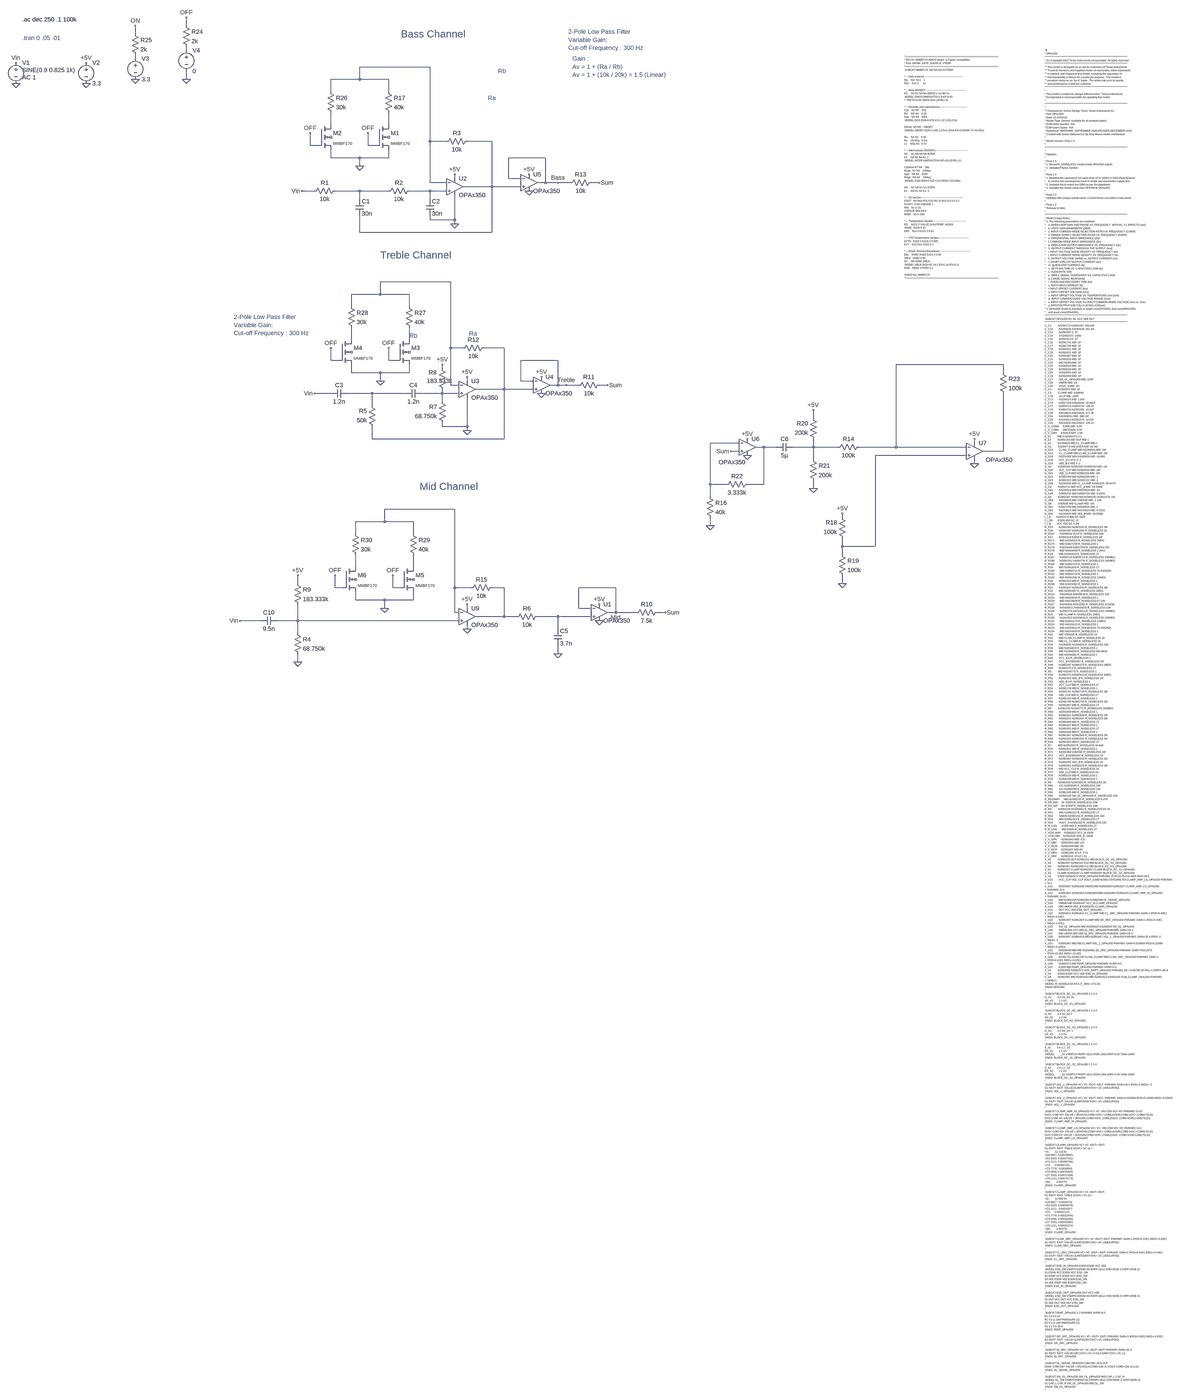
[diagram p0: schematic Filters.asc, whole sheet]
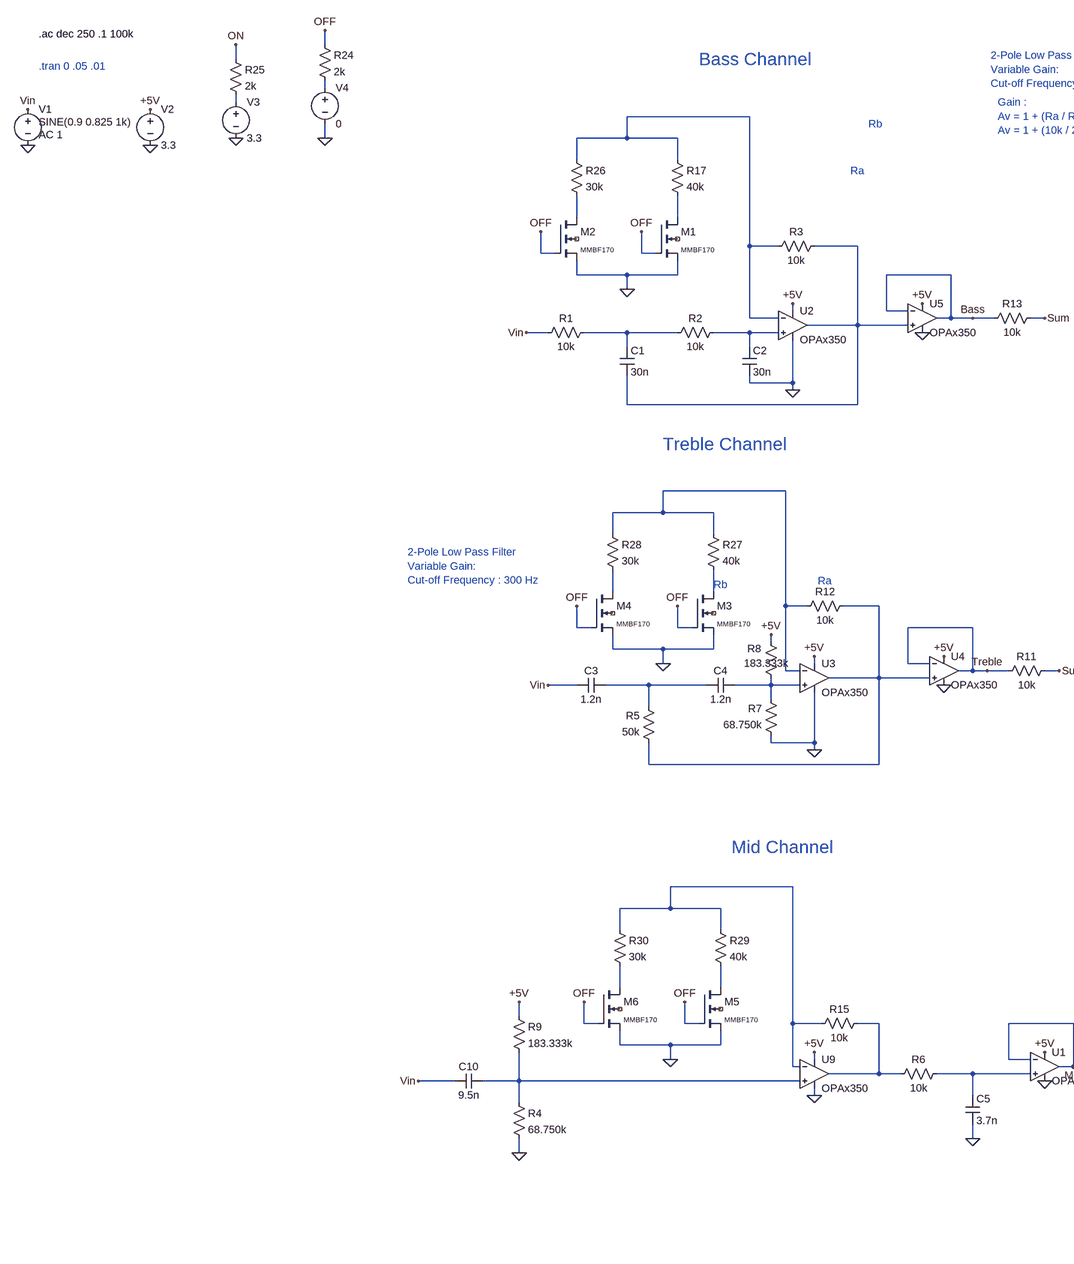
[diagram p1: schematic Filters.asc, part, row 1 of 2, column 1 of 2]
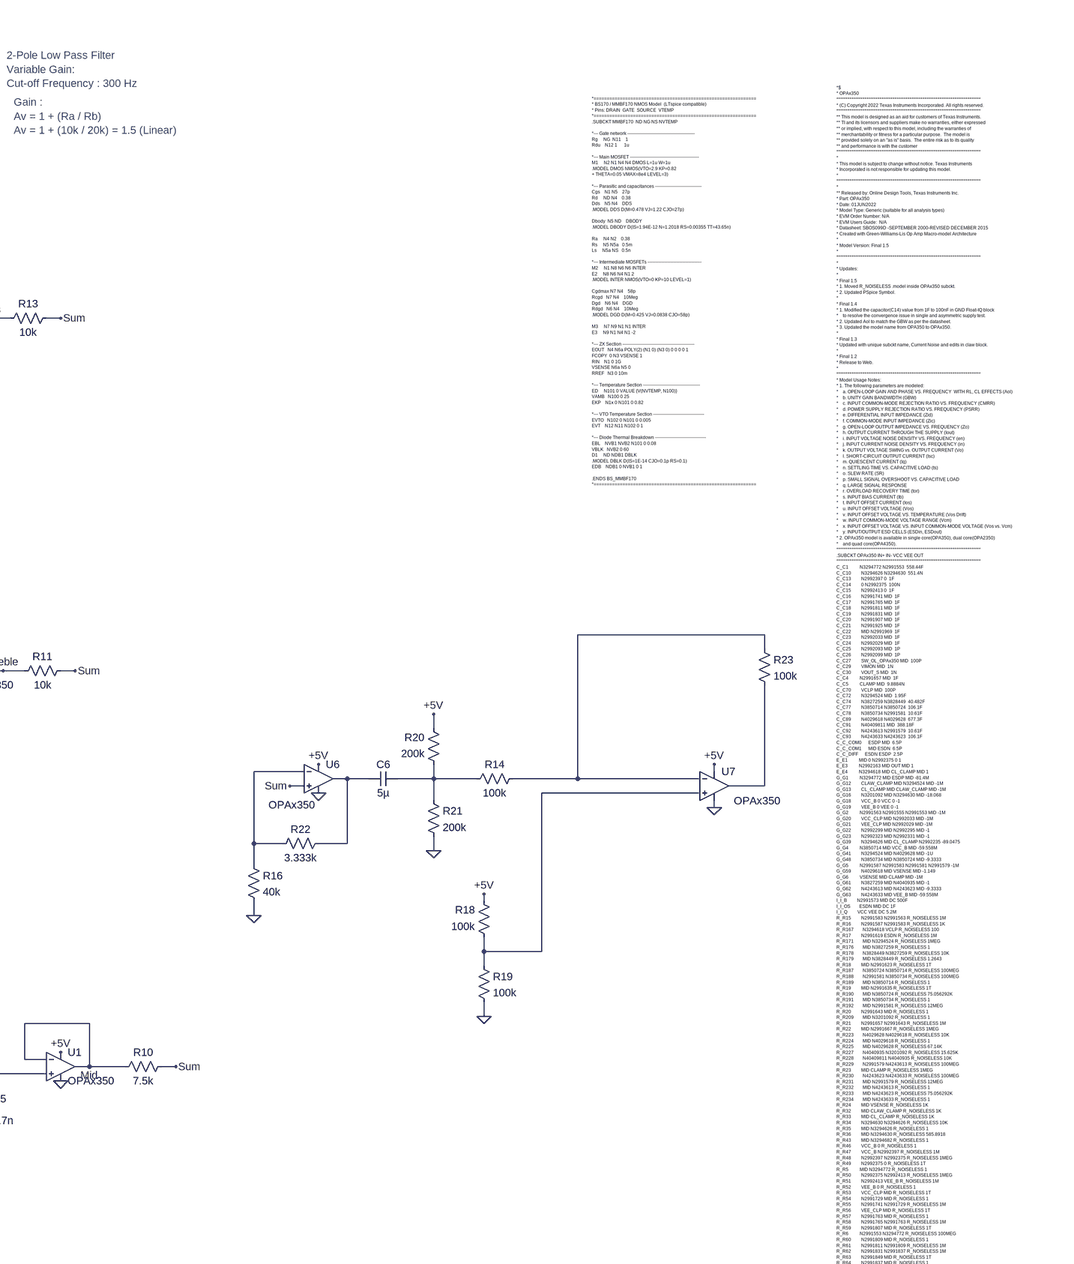
[diagram p2: schematic Filters.asc, part, row 1 of 2, column 2 of 2]
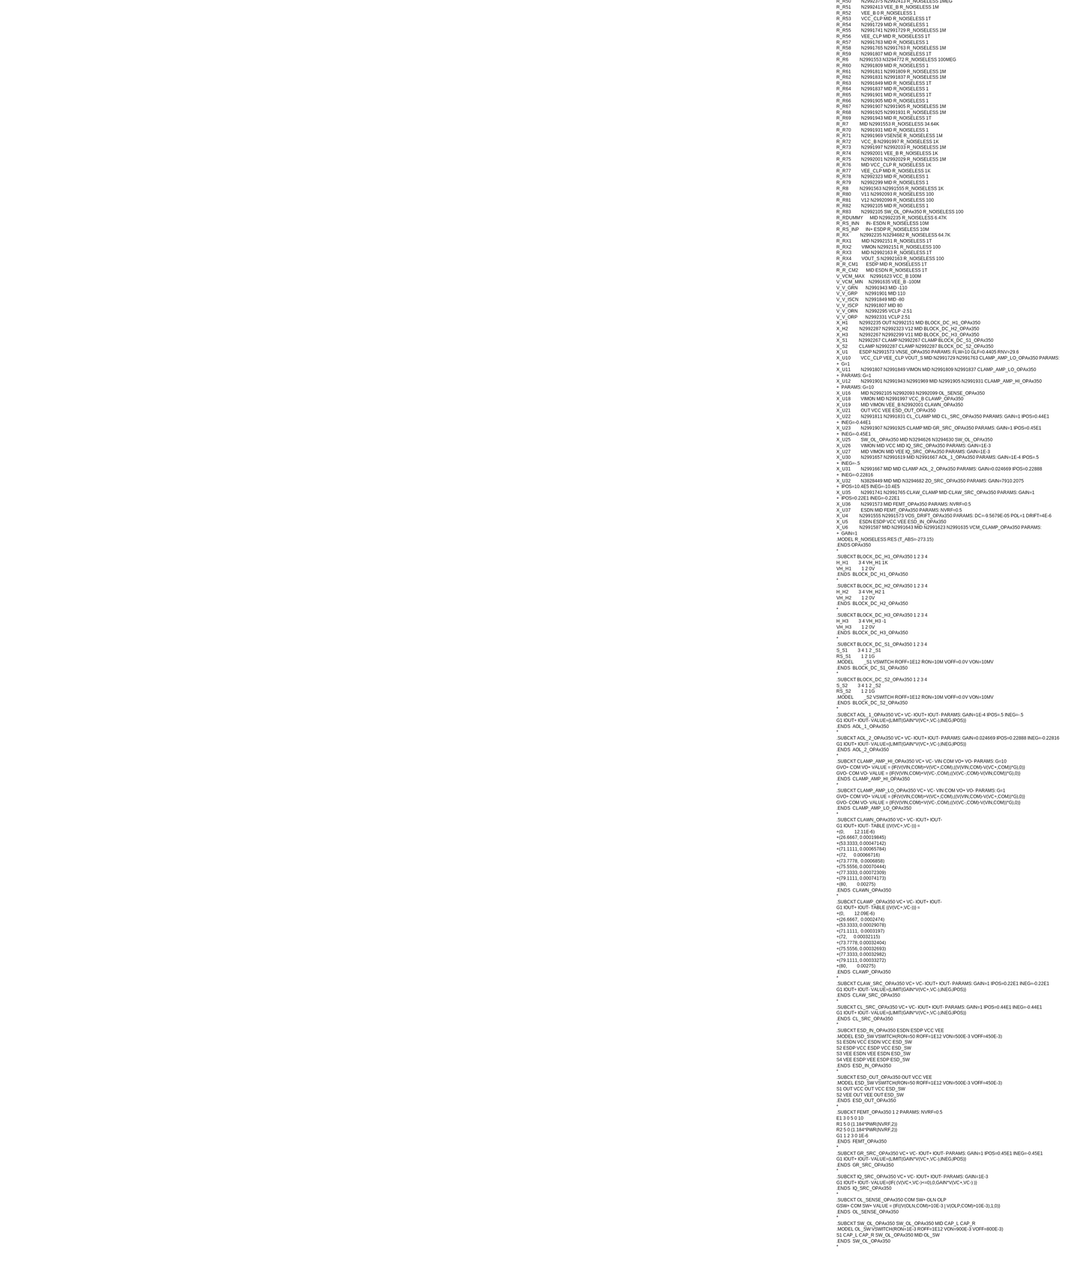
[diagram p3: schematic Filters.asc, part, row 2 of 2, column 2 of 2]
* Filters.asc
V1 Vin 0 SINE(0.9 0.825 1k) AC 1
V2 +5V 0 3.3
X§U2 N008 N003 +5V 0 N006 OPAx350  ; pins In+ In- V+ V- OUT
R1 N007 Vin 10k
R2 N008 N007 10k
C1 N007 N006 30n
C2 N008 0 30n
R3 N006 N003 10k
X§U3 N015 N009 +5V 0 N012 OPAx350  ; pins In+ In- V+ V- OUT
R5 N012 N014 50k
R7 0 N015 68.750k
C3 N014 Vin 1.2n
C4 N015 N014 1.2n
R12 N012 N009 10k
R8 +5V N015 183.333k
X§U9 N026 N021 +5V 0 N024 OPAx350  ; pins In+ In- V+ V- OUT
C10 N026 Vin 9.5n
R4 N026 0 68.750k
R6 N025 N024 10k
C5 N025 0 3.7n
R9 +5V N026 183.333k
X§U1 N025 Mid +5V 0 Mid OPAx350  ; pins In+ In- V+ V- OUT
X§U4 N012 Treble +5V 0 Treble OPAx350  ; pins In+ In- V+ V- OUT
X§U5 N006 Bass +5V 0 Bass OPAx350  ; pins In+ In- V+ V- OUT
X§U6 Sum N016 +5V 0 N017 OPAx350  ; pins In+ In- V+ V- OUT
R10 Sum Mid 7.5k
R11 Sum Treble 10k
R13 Sum Bass 10k
R15 N024 N021 10k
X§U7 N020 N013 +5V 0 N019 OPAx350  ; pins In+ In- V+ V- OUT
R14 N013 N018 100k
R18 N020 +5V 100k
R19 N020 0 100k
C6 N018 N017 5µ
R20 N018 +5V 200k
R21 N018 0 200k
R22 N017 N016 3.333k
R16 N016 0 40k
R23 N013 N019 100k
V3 N002 0 3.3
R25 ON N002 2k
X§M1 N005 OFF 0 NC_01 MMBF170  ; pins D G S B
R17 N003 N005 40k
R26 N003 N004 30k
X§M2 N004 OFF 0 NC_02 MMBF170  ; pins D G S B
X§M3 N011 OFF 0 NC_03 MMBF170  ; pins D G S B
R27 N009 N011 40k
R28 N009 N010 30k
X§M4 N010 OFF 0 NC_04 MMBF170  ; pins D G S B
X§M5 N023 OFF 0 NC_05 MMBF170  ; pins D G S B
R29 N021 N023 40k
R30 N021 N022 30k
X§M6 N022 OFF 0 NC_06 MMBF170  ; pins D G S B
V4 N001 0 0
R24 OFF N001 2k
*$
* OPAx350
*****************************************************************************
* (C) Copyright 2022 Texas Instruments Incorporated. All rights reserved.
*****************************************************************************
** This model is designed as an aid for customers of Texas Instruments.
** TI and its licensors and suppliers make no warranties, either expressed
** or implied, with respect to this model, including the warranties of
** merchantability or fitness for a particular purpose.  The model is
** provided solely on an "as is" basis.  The entire risk as to its quality
** and performance is with the customer
*****************************************************************************
*
* This model is subject to change without notice. Texas Instruments
* Incorporated is not responsible for updating this model.
*
*****************************************************************************
*
** Released by: Online Design Tools, Texas Instruments Inc.
* Part: OPAx350
* Date: 01JUN2022
* Model Type: Generic (suitable for all analysis types)
* EVM Order Number: N/A
* EVM Users Guide:  N/A
* Datasheet: SBOS099D -SEPTEMBER 2000-REVISED DECEMBER 2015
* Created with Green-Williams-Lis Op Amp Macro-model Architecture
*
* Model Version: Final 1.5
*
*****************************************************************************
*
* Updates:
*
* Final 1.5
* 1. Moved R_NOISELESS .model inside OPAx350 subckt.
* 2. Updated PSpice Symbol.
*
* Final 1.4
* 1. Modified the capacitor(C14) value from 1F to 100nF in GND Float-IQ block
*    to resolve the convergence issue in single and asymmetric supply test.
* 2. Updated Aol to match the GBW as per the datasheet.
* 3. Updated the model name from OPA350 to OPAx350.
*
* Final 1.3
* Updated with unique subckt name, Current Noise and edits in claw block.
*
* Final 1.2
* Release to Web.
*
*****************************************************************************
* Model Usage Notes:
* 1. The following parameters are modeled:
*    a. OPEN-LOOP GAIN AND PHASE VS. FREQUENCY  WITH RL, CL EFFECTS (Aol)
*    b. UNITY GAIN BANDWIDTH (GBW)
*    c. INPUT COMMON-MODE REJECTION RATIO VS. FREQUENCY (CMRR)
*    d. POWER SUPPLY REJECTION RATIO VS. FREQUENCY (PSRR)
*    e. DIFFERENTIAL INPUT IMPEDANCE (Zid)
*    f. COMMON-MODE INPUT IMPEDANCE (Zic)
*    g. OPEN-LOOP OUTPUT IMPEDANCE VS. FREQUENCY (Zo)
*    h. OUTPUT CURRENT THROUGH THE SUPPLY (Iout)
*    i. INPUT VOLTAGE NOISE DENSITY VS. FREQUENCY (en)
*    j. INPUT CURRENT NOISE DENSITY VS. FREQUENCY (in)
*    k. OUTPUT VOLTAGE SWING vs. OUTPUT CURRENT (Vo)
*    l. SHORT-CIRCUIT OUTPUT CURRENT (Isc)
*    m. QUIESCENT CURRENT (Iq)
*    n. SETTLING TIME VS. CAPACITIVE LOAD (ts)
*    o. SLEW RATE (SR)
*    p. SMALL SIGNAL OVERSHOOT VS. CAPACITIVE LOAD
*    q. LARGE SIGNAL RESPONSE
*    r. OVERLOAD RECOVERY TIME (tor)
*    s. INPUT BIAS CURRENT (Ib)
*    t. INPUT OFFSET CURRENT (Ios)
*    u. INPUT OFFSET VOLTAGE (Vos)
*    v. INPUT OFFSET VOLTAGE VS. TEMPERATURE (Vos Drift)
*    w. INPUT COMMON-MODE VOLTAGE RANGE (Vcm)
*    x. INPUT OFFSET VOLTAGE VS. INPUT COMMON-MODE VOLTAGE (Vos vs. Vcm)
*    y. INPUT/OUTPUT ESD CELLS (ESDin, ESDout)
* 2. OPAx350 model is available in single core(OPA350), dual core(OPA2350)
*    and quad core(OPA4350).
*****************************************************************************
.SUBCKT OPAx350 IN+ IN- VCC VEE OUT
*****************************************************************************
C_C1          N3294772 N2991553  558.44F
C_C10         N3294626 N3294630  551.4N
C_C13         N2992397 0  1F
C_C14         0 N2992375  100N
C_C15         N2992413 0  1F
C_C16         N2991741 MID  1F
C_C17         N2991765 MID  1F
C_C18         N2991811 MID  1F
C_C19         N2991831 MID  1F
C_C20         N2991907 MID  1F
C_C21         N2991925 MID  1F
C_C22         MID N2991969  1F
C_C23         N2992033 MID  1F
C_C24         N2992029 MID  1F
C_C25         N2992093 MID  1P
C_C26         N2992099 MID  1P
C_C27         SW_OL_OPAx350 MID  100P
C_C29         VIMON MID  1N
C_C30         VOUT_S MID  1N
C_C4          N2991657 MID  1F
C_C5          CLAMP MID  9.8884N
C_C70         VCLP MID  100P
C_C72         N3294524 MID  1.95F
C_C74         N3827259 N3828449  40.482F
C_C77         N3850714 N3850724  106.1F
C_C78         N3850734 N2991581  10.61F
C_C89         N4029618 N4029628  677.3F
C_C91         N40409811 MID  388.18F
C_C92         N4243613 N2991579  10.61F
C_C93         N4243633 N4243623  106.1F
C_C_COM0      ESDP MID  6.5P
C_C_COM1      MID ESDN  6.5P
C_C_DIFF      ESDN ESDP  2.5P
E_E1          MID 0 N2992375 0 1
E_E3          N2992163 MID OUT MID 1
E_E4          N3294618 MID CL_CLAMP MID 1
G_G1          N3294772 MID ESDP MID -81.4M
G_G12         CLAW_CLAMP MID N3294524 MID -1M
G_G13         CL_CLAMP MID CLAW_CLAMP MID -1M
G_G16         N3201092 MID N3294630 MID -18.068
G_G18         VCC_B 0 VCC 0 -1
G_G19         VEE_B 0 VEE 0 -1
G_G2          N2991563 N2991555 N2991553 MID -1M
G_G20         VCC_CLP MID N2992033 MID -1M
G_G21         VEE_CLP MID N2992029 MID -1M
G_G22         N2992299 MID N2992295 MID -1
G_G23         N2992323 MID N2992331 MID -1
G_G39         N3294626 MID CL_CLAMP N2992235 -89.0475
G_G4          N3850714 MID VCC_B MID -59.558M
G_G41         N3294524 MID N4029628 MID -1U
G_G48         N3850734 MID N3850724 MID -9.3333
G_G5          N2991587 N2991583 N2991581 N2991579 -1M
G_G59         N4029618 MID VSENSE MID -1.149
G_G6          VSENSE MID CLAMP MID -1M
G_G61         N3827259 MID N4040935 MID -1
G_G62         N4243613 MID N4243623 MID -9.3333
G_G63         N4243633 MID VEE_B MID -59.558M
I_I_B         N2991573 MID DC 500F
I_I_OS        ESDN MID DC 1F
I_I_Q         VCC VEE DC 5.2M
R_R15         N2991583 N2991563 R_NOISELESS 1M
R_R16         N2991587 N2991583 R_NOISELESS 1K
R_R167        N3294618 VCLP R_NOISELESS 100
R_R17         N2991619 ESDN R_NOISELESS 1M
R_R171        MID N3294524 R_NOISELESS 1MEG
R_R176        MID N3827259 R_NOISELESS 1
R_R178        N3828449 N3827259 R_NOISELESS 10K
R_R179        MID N3828449 R_NOISELESS 1.2643
R_R18         MID N2991623 R_NOISELESS 1T
R_R187        N3850724 N3850714 R_NOISELESS 100MEG
R_R188        N2991581 N3850734 R_NOISELESS 100MEG
R_R189        MID N3850714 R_NOISELESS 1
R_R19         MID N2991635 R_NOISELESS 1T
R_R190        MID N3850724 R_NOISELESS 75.056292K
R_R191        MID N3850734 R_NOISELESS 1
R_R192        MID N2991581 R_NOISELESS 12MEG
R_R20         N2991643 MID R_NOISELESS 1
R_R209        MID N3201092 R_NOISELESS 1
R_R21         N2991657 N2991643 R_NOISELESS 1M
R_R22         MID N2991667 R_NOISELESS 1MEG
R_R223        N4029628 N4029618 R_NOISELESS 10K
R_R224        MID N4029618 R_NOISELESS 1
R_R225        MID N4029628 R_NOISELESS 67.14K
R_R227        N4040935 N3201092 R_NOISELESS 15.625K
R_R228        N40409811 N4040935 R_NOISELESS 10K
R_R229        N2991579 N4243613 R_NOISELESS 100MEG
R_R23         MID CLAMP R_NOISELESS 1MEG
R_R230        N4243623 N4243633 R_NOISELESS 100MEG
R_R231        MID N2991579 R_NOISELESS 12MEG
R_R232        MID N4243613 R_NOISELESS 1
R_R233        MID N4243623 R_NOISELESS 75.056292K
R_R234        MID N4243633 R_NOISELESS 1
R_R24         MID VSENSE R_NOISELESS 1K
R_R32         MID CLAW_CLAMP R_NOISELESS 1K
R_R33         MID CL_CLAMP R_NOISELESS 1K
R_R34         N3294630 N3294626 R_NOISELESS 10K
R_R35         MID N3294626 R_NOISELESS 1
R_R36         MID N3294630 R_NOISELESS 585.8918
R_R43         MID N3294682 R_NOISELESS 1
R_R46         VCC_B 0 R_NOISELESS 1
R_R47         VCC_B N2992397 R_NOISELESS 1M
R_R48         N2992397 N2992375 R_NOISELESS 1MEG
R_R49         N2992375 0 R_NOISELESS 1T
R_R5          MID N3294772 R_NOISELESS 1
R_R50         N2992375 N2992413 R_NOISELESS 1MEG
R_R51         N2992413 VEE_B R_NOISELESS 1M
R_R52         VEE_B 0 R_NOISELESS 1
R_R53         VCC_CLP MID R_NOISELESS 1T
R_R54         N2991729 MID R_NOISELESS 1
R_R55         N2991741 N2991729 R_NOISELESS 1M
R_R56         VEE_CLP MID R_NOISELESS 1T
R_R57         N2991763 MID R_NOISELESS 1
R_R58         N2991765 N2991763 R_NOISELESS 1M
R_R59         N2991807 MID R_NOISELESS 1T
R_R6          N2991553 N3294772 R_NOISELESS 100MEG
R_R60         N2991809 MID R_NOISELESS 1
R_R61         N2991811 N2991809 R_NOISELESS 1M
R_R62         N2991831 N2991837 R_NOISELESS 1M
R_R63         N2991849 MID R_NOISELESS 1T
R_R64         N2991837 MID R_NOISELESS 1
R_R65         N2991901 MID R_NOISELESS 1T
R_R66         N2991905 MID R_NOISELESS 1
R_R67         N2991907 N2991905 R_NOISELESS 1M
R_R68         N2991925 N2991931 R_NOISELESS 1M
R_R69         N2991943 MID R_NOISELESS 1T
R_R7          MID N2991553 R_NOISELESS 34.64K
R_R70         N2991931 MID R_NOISELESS 1
R_R71         N2991969 VSENSE R_NOISELESS 1M
R_R72         VCC_B N2991997 R_NOISELESS 1K
R_R73         N2991997 N2992033 R_NOISELESS 1M
R_R74         N2992001 VEE_B R_NOISELESS 1K
R_R75         N2992001 N2992029 R_NOISELESS 1M
R_R76         MID VCC_CLP R_NOISELESS 1K
R_R77         VEE_CLP MID R_NOISELESS 1K
R_R78         N2992323 MID R_NOISELESS 1
R_R79         N2992299 MID R_NOISELESS 1
R_R8          N2991563 N2991555 R_NOISELESS 1K
R_R80         V11 N2992093 R_NOISELESS 100
R_R81         V12 N2992099 R_NOISELESS 100
R_R82         N2992105 MID R_NOISELESS 1
R_R83         N2992105 SW_OL_OPAx350 R_NOISELESS 100
R_RDUMMY      MID N2992235 R_NOISELESS 6.47K
R_RS_INN      IN- ESDN R_NOISELESS 10M
R_RS_INP      IN+ ESDP R_NOISELESS 10M
R_RX          N2992235 N3294682 R_NOISELESS 64.7K
R_RX1         MID N2992151 R_NOISELESS 1T
R_RX2         VIMON N2992151 R_NOISELESS 100
R_RX3         MID N2992163 R_NOISELESS 1T
R_RX4         VOUT_S N2992163 R_NOISELESS 100
R_R_CM1       ESDP MID R_NOISELESS 1T
R_R_CM2       MID ESDN R_NOISELESS 1T
V_VCM_MAX     N2991623 VCC_B 100M
V_VCM_MIN     N2991635 VEE_B -100M
V_V_GRN       N2991943 MID -110
V_V_GRP       N2991901 MID 110
V_V_ISCN      N2991849 MID -80
V_V_ISCP      N2991807 MID 80
V_V_ORN       N2992295 VCLP -2.51
V_V_ORP       N2992331 VCLP 2.51
X_H1          N2992235 OUT N2992151 MID BLOCK_DC_H1_OPAx350
X_H2          N2992287 N2992323 V12 MID BLOCK_DC_H2_OPAx350
X_H3          N2992267 N2992299 V11 MID BLOCK_DC_H3_OPAx350
X_S1          N2992267 CLAMP N2992267 CLAMP BLOCK_DC_S1_OPAx350
X_S2          CLAMP N2992287 CLAMP N2992287 BLOCK_DC_S2_OPAx350
X_U1          ESDP N2991573 VNSE_OPAx350 PARAMS: FLW=10 GLF=0.4405 RNV=29.6
X_U10         VCC_CLP VEE_CLP VOUT_S MID N2991729 N2991763 CLAMP_AMP_LO_OPAx350 PARAMS:
+  G=1
X_U11         N2991807 N2991849 VIMON MID N2991809 N2991837 CLAMP_AMP_LO_OPAx350
+  PARAMS: G=1
X_U12         N2991901 N2991943 N2991969 MID N2991905 N2991931 CLAMP_AMP_HI_OPAx350
+  PARAMS: G=10
X_U16         MID N2992105 N2992093 N2992099 OL_SENSE_OPAx350
X_U18         VIMON MID N2991997 VCC_B CLAWP_OPAx350
X_U19         MID VIMON VEE_B N2992001 CLAWN_OPAx350
X_U21         OUT VCC VEE ESD_OUT_OPAx350
X_U22         N2991811 N2991831 CL_CLAMP MID CL_SRC_OPAx350 PARAMS: GAIN=1 IPOS=0.44E1
+  INEG=-0.44E1
X_U23         N2991907 N2991925 CLAMP MID GR_SRC_OPAx350 PARAMS: GAIN=1 IPOS=0.45E1
+  INEG=-0.45E1
X_U25         SW_OL_OPAx350 MID N3294626 N3294630 SW_OL_OPAx350
X_U26         VIMON MID VCC MID IQ_SRC_OPAx350 PARAMS: GAIN=1E-3
X_U27         MID VIMON MID VEE IQ_SRC_OPAx350 PARAMS: GAIN=1E-3
X_U30         N2991657 N2991619 MID N2991667 AOL_1_OPAx350 PARAMS: GAIN=1E-4 IPOS=.5
+  INEG=-.5
X_U31         N2991667 MID MID CLAMP AOL_2_OPAx350 PARAMS: GAIN=0.024669 IPOS=0.22888
+  INEG=-0.22816
X_U32         N3828449 MID MID N3294682 ZO_SRC_OPAx350 PARAMS: GAIN=7910.2075
+  IPOS=10.4E5 INEG=-10.4E5
X_U35         N2991741 N2991765 CLAW_CLAMP MID CLAW_SRC_OPAx350 PARAMS: GAIN=1
+  IPOS=0.22E1 INEG=-0.22E1
X_U36         N2991573 MID FEMT_OPAx350 PARAMS: NVRF=0.5
X_U37         ESDN MID FEMT_OPAx350 PARAMS: NVRF=0.5
X_U4          N2991555 N2991573 VOS_DRIFT_OPAx350 PARAMS: DC=-9.5679E-05 POL=1 DRIFT=4E-6
X_U5          ESDN ESDP VCC VEE ESD_IN_OPAx350
X_U6          N2991587 MID N2991643 MID N2991623 N2991635 VCM_CLAMP_OPAx350 PARAMS:
+  GAIN=1
.MODEL R_NOISELESS RES (T_ABS=-273.15)
.ENDS OPAx350
*
.SUBCKT BLOCK_DC_H1_OPAx350 1 2 3 4
H_H1         3 4 VH_H1 1K
VH_H1         1 2 0V
.ENDS  BLOCK_DC_H1_OPAx350
*
.SUBCKT BLOCK_DC_H2_OPAx350 1 2 3 4
H_H2         3 4 VH_H2 1
VH_H2         1 2 0V
.ENDS  BLOCK_DC_H2_OPAx350
*
.SUBCKT BLOCK_DC_H3_OPAx350 1 2 3 4
H_H3         3 4 VH_H3 -1
VH_H3         1 2 0V
.ENDS  BLOCK_DC_H3_OPAx350
*
.SUBCKT BLOCK_DC_S1_OPAx350 1 2 3 4
S_S1         3 4 1 2 _S1
RS_S1         1 2 1G
.MODEL         _S1 VSWITCH ROFF=1E12 RON=10M VOFF=0.0V VON=10MV
.ENDS  BLOCK_DC_S1_OPAx350
*
.SUBCKT BLOCK_DC_S2_OPAx350 1 2 3 4
S_S2         3 4 1 2 _S2
RS_S2         1 2 1G
.MODEL         _S2 VSWITCH ROFF=1E12 RON=10M VOFF=0.0V VON=10MV
.ENDS  BLOCK_DC_S2_OPAx350
*
.SUBCKT AOL_1_OPAx350 VC+ VC- IOUT+ IOUT- PARAMS: GAIN=1E-4 IPOS=.5 INEG=-.5
G1 IOUT+ IOUT- VALUE={LIMIT(GAIN*V(VC+,VC-),INEG,IPOS)}
.ENDS  AOL_1_OPAx350
*
.SUBCKT AOL_2_OPAx350 VC+ VC- IOUT+ IOUT- PARAMS: GAIN=0.024669 IPOS=0.22888 INEG=-0.22816
G1 IOUT+ IOUT- VALUE={LIMIT(GAIN*V(VC+,VC-),INEG,IPOS)}
.ENDS  AOL_2_OPAx350
*
.SUBCKT CLAMP_AMP_HI_OPAx350 VC+ VC- VIN COM VO+ VO- PARAMS: G=10
GVO+ COM VO+ VALUE = {IF(V(VIN,COM)>V(VC+,COM),((V(VIN,COM)-V(VC+,COM))*G),0)}
GVO- COM VO- VALUE = {IF(V(VIN,COM)<V(VC-,COM),((V(VC-,COM)-V(VIN,COM))*G),0)}
.ENDS  CLAMP_AMP_HI_OPAx350
*
.SUBCKT CLAMP_AMP_LO_OPAx350 VC+ VC- VIN COM VO+ VO- PARAMS: G=1
GVO+ COM VO+ VALUE = {IF(V(VIN,COM)>V(VC+,COM),((V(VIN,COM)-V(VC+,COM))*G),0)}
GVO- COM VO- VALUE = {IF(V(VIN,COM)<V(VC-,COM),((V(VC-,COM)-V(VIN,COM))*G),0)}
.ENDS  CLAMP_AMP_LO_OPAx350
*
.SUBCKT CLAWN_OPAx350 VC+ VC- IOUT+ IOUT-
G1 IOUT+ IOUT- TABLE {(V(VC+,VC-))} =
+(0,         12.11E-6)
+(26.6667, 0.00019845)
+(53.3333, 0.00047142)
+(71.1111, 0.00065784)
+(72,      0.00066716)
+(73.7778,  0.0006858)
+(75.5556, 0.00070444)
+(77.3333, 0.00072309)
+(79.1111, 0.00074173)
+(80,         0.00275)
.ENDS  CLAWN_OPAx350
*
.SUBCKT CLAWP_OPAx350 VC+ VC- IOUT+ IOUT-
G1 IOUT+ IOUT- TABLE {(V(VC+,VC-))} =
+(0,         12.09E-6)
+(26.6667,  0.0002474)
+(53.3333, 0.00029078)
+(71.1111,  0.0003197)
+(72,      0.00032115)
+(73.7778, 0.00032404)
+(75.5556, 0.00032693)
+(77.3333, 0.00032982)
+(79.1111, 0.00033272)
+(80,         0.00275)
.ENDS  CLAWP_OPAx350
*
.SUBCKT CLAW_SRC_OPAx350 VC+ VC- IOUT+ IOUT- PARAMS: GAIN=1 IPOS=0.22E1 INEG=-0.22E1
G1 IOUT+ IOUT- VALUE={LIMIT(GAIN*V(VC+,VC-),INEG,IPOS)}
.ENDS  CLAW_SRC_OPAx350
*
.SUBCKT CL_SRC_OPAx350 VC+ VC- IOUT+ IOUT- PARAMS: GAIN=1 IPOS=0.44E1 INEG=-0.44E1
G1 IOUT+ IOUT- VALUE={LIMIT(GAIN*V(VC+,VC-),INEG,IPOS)}
.ENDS  CL_SRC_OPAx350
*
.SUBCKT ESD_IN_OPAx350 ESDN ESDP VCC VEE
.MODEL ESD_SW VSWITCH(RON=50 ROFF=1E12 VON=500E-3 VOFF=450E-3)
S1 ESDN VCC ESDN VCC ESD_SW
S2 ESDP VCC ESDP VCC ESD_SW
S3 VEE ESDN VEE ESDN ESD_SW
S4 VEE ESDP VEE ESDP ESD_SW
.ENDS  ESD_IN_OPAx350
*
.SUBCKT ESD_OUT_OPAx350 OUT VCC VEE
.MODEL ESD_SW VSWITCH(RON=50 ROFF=1E12 VON=500E-3 VOFF=450E-3)
S1 OUT VCC OUT VCC ESD_SW
S2 VEE OUT VEE OUT ESD_SW
.ENDS  ESD_OUT_OPAx350
*
.SUBCKT FEMT_OPAx350 1 2 PARAMS: NVRF=0.5
E1 3 0 5 0 10
R1 5 0 {1.184*PWR(NVRF,2)}
R2 5 0 {1.184*PWR(NVRF,2)}
G1 1 2 3 0 1E-6
.ENDS  FEMT_OPAx350
*
.SUBCKT GR_SRC_OPAx350 VC+ VC- IOUT+ IOUT- PARAMS: GAIN=1 IPOS=0.45E1 INEG=-0.45E1
G1 IOUT+ IOUT- VALUE={LIMIT(GAIN*V(VC+,VC-),INEG,IPOS)}
.ENDS  GR_SRC_OPAx350
*
.SUBCKT IQ_SRC_OPAx350 VC+ VC- IOUT+ IOUT- PARAMS: GAIN=1E-3
G1 IOUT+ IOUT- VALUE={IF( (V(VC+,VC-)<=0),0,GAIN*V(VC+,VC-) )}
.ENDS  IQ_SRC_OPAx350
*
.SUBCKT OL_SENSE_OPAx350 COM SW+ OLN OLP
GSW+ COM SW+ VALUE = {IF((V(OLN,COM)>10E-3 | V(OLP,COM)>10E-3),1,0)}
.ENDS  OL_SENSE_OPAx350
*
.SUBCKT SW_OL_OPAx350 SW_OL_OPAx350 MID CAP_L CAP_R
.MODEL OL_SW VSWITCH(RON=1E-3 ROFF=1E12 VON=900E-3 VOFF=800E-3)
S1 CAP_L CAP_R SW_OL_OPAx350 MID OL_SW
.ENDS  SW_OL_OPAx350
*
.SUBCKT VCM_CLAMP_OPAx350 VIN+ VIN- IOUT- IOUT+ VP+ VP- PARAMS: GAIN=1
G1 IOUT+ IOUT- VALUE={LIMIT(GAIN*V(VIN+,VIN-),V(VP-,VIN-), V(VP+,VIN-))}
.ENDS  VCM_CLAMP_OPAx350
*
.SUBCKT VNSE_OPAx350 1 2 PARAMS: FLW=10 GLF=0.4405 RNV=29.6
.MODEL DVN D KF={PWR(FLW,0.5)/1E11} IS=1.0E-16
I1 0 7 10E-3
I2 0 8 10E-3
D1 7 0 DVN
D2 8 0 DVN
E1 3 6 7 8 {GLF}
R1 3 0 1E9
R2 3 0 1E9
R3 3 6 1E9
E2 6 4 5 0 10
R4 5 0 {RNV}
R5 5 0 {RNV}
R6 3 4 1E9
R7 4 0 1E9
E3 1 2 3 4 1
.ENDS  VNSE_OPAx350
*
.SUBCKT VOS_DRIFT_OPAx350 VOS+ VOS- PARAMS: DC=-9.5679E-05 POL=1 DRIFT=4E-6
E1 VOS+ VOS- VALUE={DC+POL*DRIFT*(TEMP-27)}
.ENDS  VOS_DRIFT_OPAx350
*
.SUBCKT ZO_SRC_OPAx350 VC+ VC- IOUT+ IOUT- PARAMS: GAIN=7910.2075 IPOS=10.4E5 INEG=-10.4E5
G1 IOUT+ IOUT- VALUE={LIMIT(GAIN*V(VC+,VC-),INEG,IPOS)}
.ENDS  ZO_SRC_OPAx350
*
* Bass Channel
* 2-Pole Low Pass Filter
* Variable Gain:
* Cut-off Frequency : 300 Hz
* Ra
* Rb
* Gain :
* Av = 1 + (Ra / Rb)
* Av = 1 + (10k / 20k) = 1.5 (Linear)
* Treble Channel
* 2-Pole Low Pass Filter
* Variable Gain:
* Cut-off Frequency : 300 Hz
* Ra
* Rb
* Mid Channel
*==============================================================
* BS170 / MMBF170 NMOS Model  (LTspice compatible)
* Pins: DRAIN  GATE  SOURCE  VTEMP
*==============================================================
.SUBCKT MMBF170  ND NG NS NVTEMP
*--- Gate network ---------------------------------------------
Rg     NG  N11    1
Rdu    N12 1      1u
*--- Main MOSFET ----------------------------------------------
M1     N2 N1 N4 N4 DMOS L=1u W=1u
.MODEL DMOS NMOS(VTO=2.9 KP=0.82
+ THETA=0.05 VMAX=8e4 LEVEL=3)
*--- Parasitic and capacitances -------------------------------
Cgs    N1 N5    27p
Rd     ND N4    0.38
Dds    N5 N4    DDS
.MODEL DDS D(M=0.478 VJ=1.22 CJO=27p)
Dbody  N5 ND    DBODY
.MODEL DBODY D(IS=1.94E-12 N=1.2018 RS=0.00355 TT=43.65n)
Ra     N4 N2    0.38
Rs     N5 N5a   0.5m
Ls     N5a NS   0.5n
*--- Intermediate MOSFETs ------------------------------------
M2     N1 N8 N6 N6 INTER
E2     N8 N6 N4 N1 2
.MODEL INTER NMOS(VTO=0 KP=10 LEVEL=1)
Cgdmax N7 N4    58p
Rcgd   N7 N4    10Meg
Dgd    N6 N4    DGD
Rdgd   N6 N4    10Meg
.MODEL DGD D(M=0.425 VJ=0.0838 CJO=58p)
M3     N7 N9 N1 N1 INTER
E3     N9 N1 N4 N1 -2
*--- ZX Section ------------------------------------------------
EOUT   N4 N6a POLY(2) (N1 0) (N3 0) 0 0 0 0 1
FCOPY  0 N3 VSENSE 1
RIN    N1 0 1G
VSENSE N6a N5 0
RREF   N3 0 10m
*--- Temperature Section --------------------------------------
ED     N101 0 VALUE {V(NVTEMP, N100)}
VAMB   N100 0 25
EKP    N1x 0 N101 0 0.82
*--- VTO Temperature Section ----------------------------------
EVTO   N102 0 N101 0 0.005
EVT    N12 N11 N102 0 1
*--- Diode Thermal Breakdown ----------------------------------
EBL    NVB1 NVB2 N101 0 0.08
VBLK   NVB2 0 60
D1     ND NDB1 DBLK
.MODEL DBLK D(IS=1E-14 CJO=0.1p RS=0.1)
EDB    NDB1 0 NVB1 0 1
.ENDS BS_MMBF170
*==============================================================
.ac dec 250 .1 100k
* .tran 0 .05 .01
.backanno
.end